# Altium schematic sheet Sheet1.SchDoc
size A4; SheetNumber: 1; SheetTotal: 1
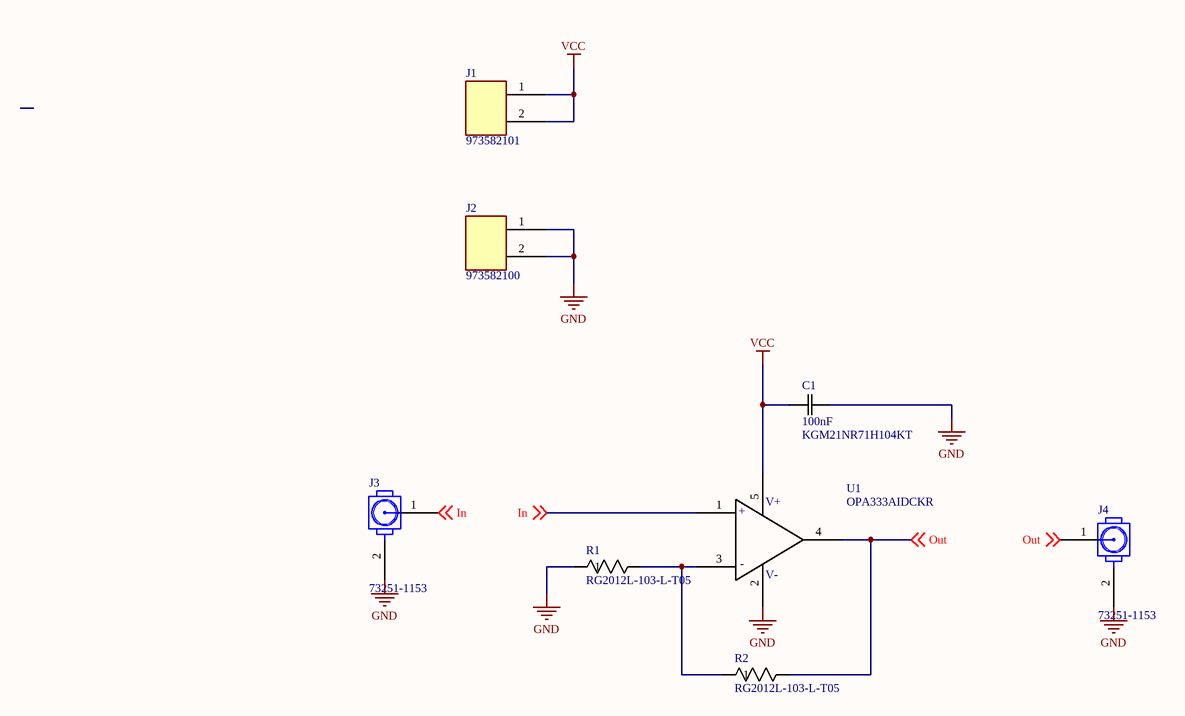
[diagram p0: Sheet1.SchDoc]

## Parts
C1  KGM21NR71H104KT  value 100nF  [CAP_KGM21_KAV]
J1  973582101  [CON_973582101_Red]
J2  973582100  [CON_973582100_Black]
J3  73251-1153  [73251-1153]
J4  73251-1153  [73251-1153]
R1  RG2012L-103-L-T05  [RES_1220_SUS]
R2  RG2012L-103-L-T05  [RES_1220_SUS]
U1  OPA333AIDCKR  [SC70+5_0.95X0.4_0.65_SMD]

## Nets
GND: C1.2 J2.1 J2.2 J3.2 J4.2 R1.1 U1.2(V-)
VCC: C1.1 J1.1 J1.2 U1.5(V+)
In: J3.1 U1.1(+IN) ; off-sheet In
Out: J4.1 R2.2 U1.4(OUT) ; off-sheet Out
NetR1_2: R1.2 R2.1 U1.3(-IN)

## Notes on the sheet
- (in symbol IC_OPA333AIDCKR) +; -

## Library data of the parts
C1 = CAP_100nF_0805_SMD: CAP CER 100nF
J1 = CON_973582101_Red: Red Banana Connector; Manufacturer: Altech Corp; Manufacturer Number: 973582101
J2 = CON_973582100: Black Banana Connector; Manufacturer: Altech Corp; Manufacturer Number: 973582100
J3 J4 = 73251-1153: SMA Connector; Manufacturer: Molex; Manufacturer Part Number: 73251-1153
R1 R2 = RES_10k_0805_SMD: Resistor 10k Ohm 0805 SMD
U1 = IC_OPA333AIDCKR: OP Amp; Manufacturer: TI; Manufactucture Numer: OPA333AIDCKR